# EAGLE schematic PDB_PCB_sch (EAGLE 9.6.2)
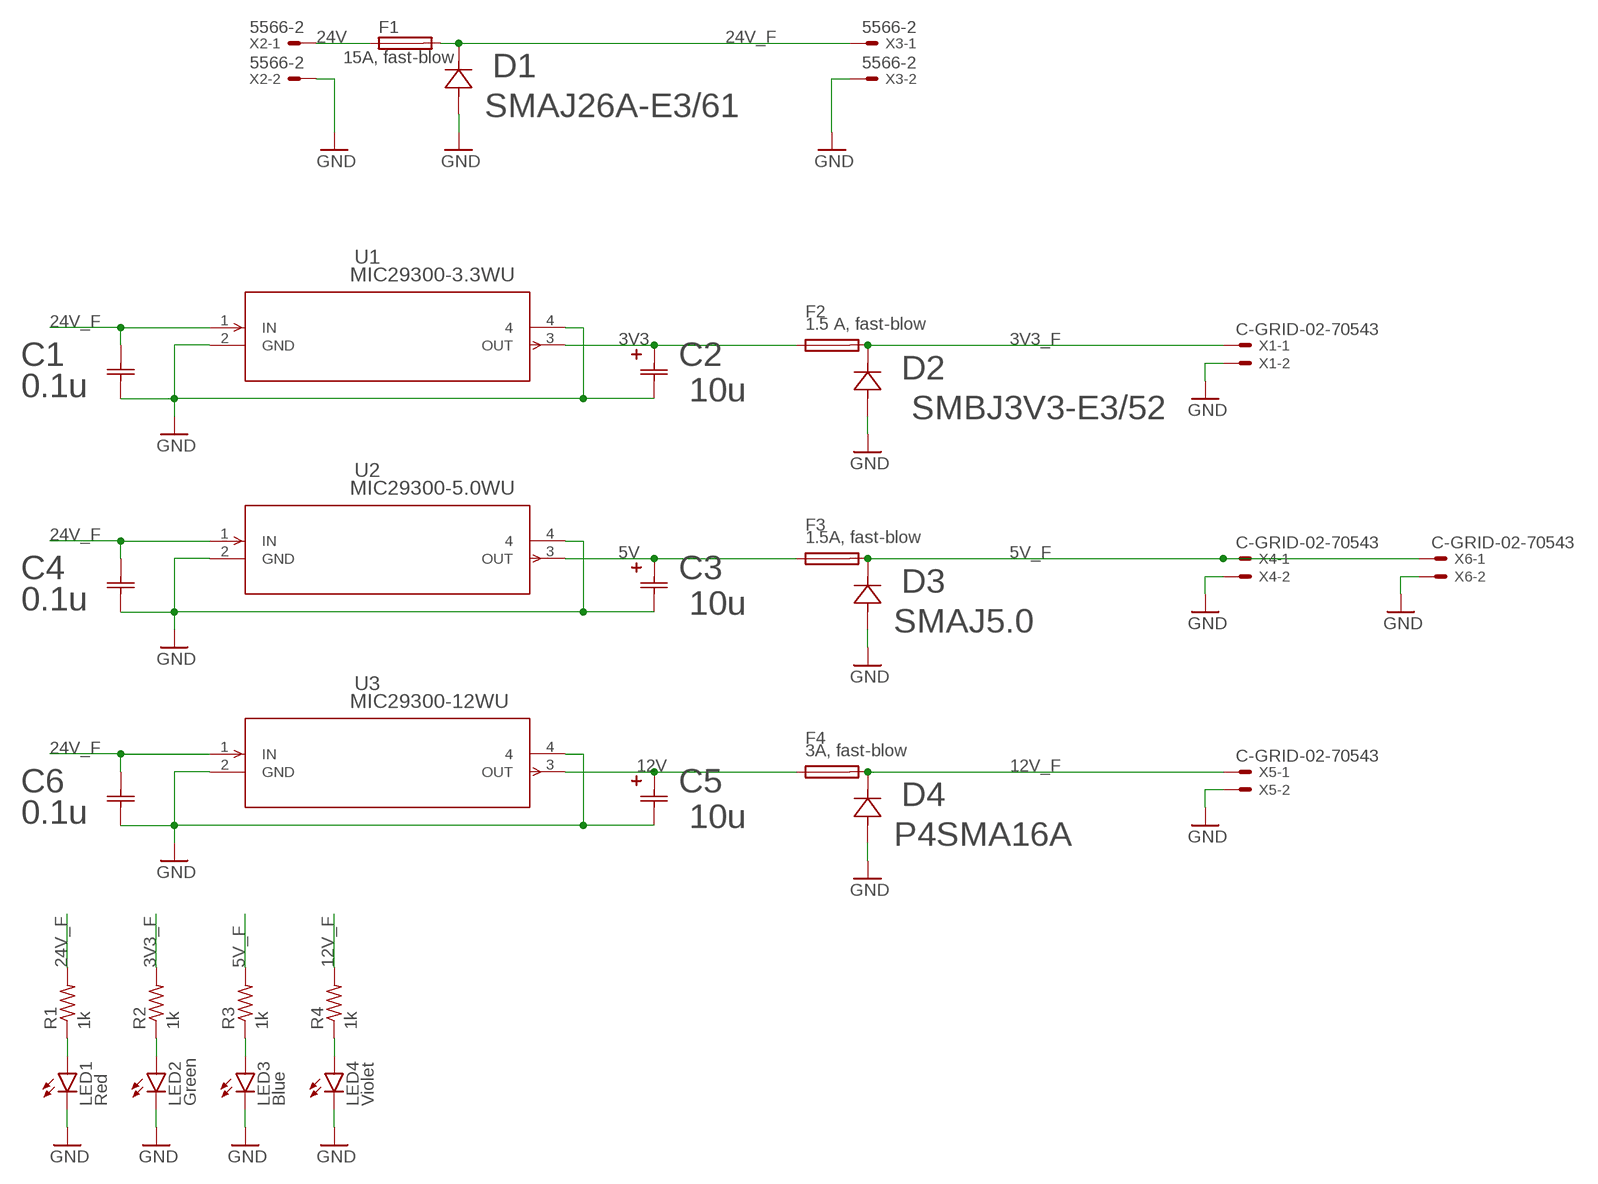
[diagram p0: schematic, sheet 1]

## Parts
C1  0.1u  0402B104M500CT  [CAP_0402_WAL]
C2  10u  TCSM1C106M8R  [CAP_TCS_M_ROM]
C3  10u  TCSM1C106M8R  [CAP_TCS_M_ROM]
C4  0.1u  0402B104M500CT  [CAP_0402_WAL]
C5  10u  TCSM1C106M8R  [CAP_TCS_M_ROM]
C6  0.1u  0402B104M500CT  [CAP_0402_WAL]
D1  SMAJ26A-E3/61  [DIODE_DO-214AC]
D2  SMBJ3V3-E3/52  [DO-214AC_VIS]
D3  SMAJ5.0  [SMASERIES_LTF]
D4  P4SMA16A  [P4SMASERIES_LTF]
F1  15A, fast-blow  TE5  [TE5]
F2  1.5 A, fast-blow  TE5  [TE5]
F3  1.5A, fast-blow  TE5  [TE5]
F4  3A, fast-blow  TE5  [TE5]
LED1  Red  LEDSMT1206  [1206]
LED2  Green  LEDSMT1206  [1206]
LED3  Blue  LEDSMT1206  [1206]
LED4  Violet  LEDSMT1206  [1206]
R1  1k  R-US_R0402  [R0402]
R2  1k  R-US_R0402  [R0402]
R3  1k  R-US_R0402  [R0402]
R4  1k  R-US_R0402  [R0402]
U1  MIC29300-3.3WU  [TO-263-3_MCL]
U2  MIC29300-5.0WU  [TO-263-3_MCL]
U3  MIC29300-12WU  [TO-263-3_MCL]
X1  C-GRID-02-70543  [70543-02]
X2  5566-2  [5566-2]
X3  5566-2  [5566-2]
X4  C-GRID-02-70543  [70543-02]
X5  C-GRID-02-70543  [70543-02]
X6  C-GRID-02-70543  [70543-02]

## Nets
3V3: C2.2 F2.1 U1.3(OUT)
3V3_F: D2.11 F2.2 R2.2 X1.1
5V: C3.2 F3.1 U2.3(OUT)
5V_F: D3.1 F3.2 R3.2 X4.1 X6.1
12V: C5.2 F4.1 U3.3(OUT)
12V_F: D4.1 F4.2 R4.2 X5.1
24V: F1.1 X2.1
24V_F: C1.1 C4.1 C6.1 R1.2 U1.1(IN) U2.1(IN) U3.1(IN)
GND: C1.2 C2.1 C3.1 C4.2 C5.1 C6.2 D1.2 D2.12 D3.2 D4.2 LED1.C LED2.C LED3.C LED4.C U1.2(GND) U1.4 U2.2(GND) U2.4 U3.2(GND) U3.4 X1.2 X2.2 X3.2 X4.2 X5.2 X6.2
N$1: LED1.A R1.1
N$3: LED2.A R2.1
N$5: LED3.A R3.1
N$6: D1.1 F1.2 X3.1
N$8: LED4.A R4.1

## Library data of the parts
C1 C4 C6 = PDB_PCB_lbr:0402B104M500CT; COPYRIGHT: Copyright (C) 2022 Ultra Librarian. All rights reserved.; DIGI-KEY_PART_NUMBER_1: 1292-1179-2-ND; DIGI-KEY_PART_NUMBER_2: 1292-1179-1-ND; DIGI-KEY_PART_NUMBER_3: 1292-1179-6-ND; MANUFACTURER_PART_NUMBER: 0402B104M500CT; MFR_NAME: Walsin
C2 C3 C5 = PDB_PCB_lbr:TCSM1C106M8R; COPYRIGHT: Copyright (C) 2022 Ultra Librarian. All rights reserved.; DIGI-KEY_PART_NUMBER_1: 511-TCSM1C106M8RTR-ND; DIGI-KEY_PART_NUMBER_2: 511-TCSM1C106M8RCT-ND; DIGI-KEY_PART_NUMBER_3: 511-TCSM1C106M8RDKR-ND; MANUFACTURER_PART_NUMBER: TCSM1C106M8R; MFR_NAME: ROHM Semiconductor
D1 = PDB_PCB_lbr:SMAJ26A-E3/61; COPYRIGHT: Copyright (C) 2022 Ultra Librarian. All rights reserved.; DIGI-KEY_PART_NUMBER_1: SMAJ26A-E3/61GICT-ND; DIGI-KEY_PART_NUMBER_2: SMAJ26A-E3/61GIDKR-ND; DIGI-KEY_PART_NUMBER_3: SMAJ26A-E3/61GITR-ND; MANUFACTURER_PART_NUMBER: SMAJ26A-E3/61; MFR_NAME: Vishay
D2 = PDB_PCB_lbr:SMBJ3V3-E3/52; COPYRIGHT: Copyright (C) 2022 Ultra Librarian. All rights reserved.; MANUFACTURER_PART_NUMBER: SMBJ3V3-E3/52; MFR_NAME: Vishay
D3 = PDB_PCB_lbr:SMAJ5.0; COPYRIGHT: Copyright (C) 2022 Ultra Librarian. All rights reserved.; DIGI-KEY_PART_NUMBER_1: F5678CT-ND; DIGI-KEY_PART_NUMBER_2: F5678DKR-ND; DIGI-KEY_PART_NUMBER_3: F5678TR-ND; DIGI-KEY_PART_NUMBER_4: 2997-SMAJ5.0TR-ND; MANUFACTURER_PART_NUMBER: SMAJ5.0; MFR_NAME: Littelfuse Inc
D4 = PDB_PCB_lbr:P4SMA16A; COPYRIGHT: Copyright (C) 2022 Ultra Librarian. All rights reserved.; DIGI-KEY_PART_NUMBER_1: 283-P4SMA16ATR-ND; DIGI-KEY_PART_NUMBER_2: 2997-P4SMA16ATR-ND; DIGI-KEY_PART_NUMBER_3: P4SMA16ABBCT-ND; DIGI-KEY_PART_NUMBER_4: P4SMA16ABBDKR-ND; DIGI-KEY_PART_NUMBER_5: P4SMA16ABBTR-ND; DIGI-KEY_PART_NUMBER_6: P4SMA16ACT-ND; DIGI-KEY_PART_NUMBER_7: P4SMA16ADKR-ND; DIGI-KEY_PART_NUMBER_8: P4SMA16ATR-ND; MANUFACTURER_PART_NUMBER: P4SMA16A; MFR_NAME: Littelfuse Inc
F1-F4 = fuse:TE5: FUSE Wickmann; OC_FARNELL: unknown; OC_NEWARK: unknown
LED1-LED4 = led:LED: LED OSRAM: - CHIPLED LG R971, LG N971, LY N971, LG Q971, LY Q971, LO R971, LY R971 LH N974, LH R974 LS Q976, LO Q976, LY Q976 LO Q996 - Hyper CHIPLED LW Q18S LB Q993, LB Q99A, LB R99A - SideLED LS A670, LO A670, LY A670, LG A670, LP A670 LB A673, LV A673, LT A673, LW A673 LH A674 LY A675 LS A676, LA A676, LO A676, LY A676, LW A676 LS A679, LY A679, LG A679 - Hyper Micro SIDELED® LS Y876, LA Y876, LO Y876, LY Y876 LT Y87S - SmartLED LW L88C, LW L88S LB L89C, LB L89S, LG L890 LS L89K, LO L89K, LY L89K LS L896, LA L896, LO L896, LY L896 - TOPLED LS T670, LO T670, LY T670, LG T670, LP T670 LSG T670, LSP T670, LSY T670, LOP T670, LYG T670 LG T671, LOG T671, LSG T671 LB T673, LV T673, LT T673, LW T673 LH T674 LS T676, LA T676, LO T676, LY T676, LB T676, LH T676, LSB T676, LW T676 LB T67C, LV T67C, LT T67C, LS T67K, LO T67K, LY T67K, LW E67C LS E67B, LA E67B, LO E67B, LY E67B, LB E67C, LV E67C, LT E67C LW T67C LS T679, LY T679, LG T679 LS T770, LO T770, LY T770, LG T770, LP T770 LB T773, LV T773, LT T773, LW T773 LH T774 LS E675, LA E675, LY E675, LS T675 LS T776, LA T776, LO T776, LY T776, LB T776 LHGB T686 LT T68C, LB T68C - Hyper Mini TOPLED® LB M676 - Mini TOPLED Santana® LG M470 LS M47K, LO M47K, LY M47K Source: http://www.osram.convergy.de LUXEON: - LUMILED® LXK2-PW12-R00, LXK2-PW12-S00, LXK2-PW14-U00, LXK2-PW14-V00 LXK2-PM12-R00, LXK2-PM12-S00, LXK2-PM14-U00 LXK2-PE12-Q00, LXK2-PE12-R00, LXK2-PE12-S00, LXK2-PE14-T00, LXK2-PE14-U00 LXK2-PB12-K00, LXK2-PB12-L00, LXK2-PB12-M00, LXK2-PB14-N00, LXK2-PB14-P00, LXK2-PB14-Q00 LXK2-PR12-L00, LXK2-PR12-M00, LXK2-PR14-Q00, LXK2-PR14-R00 LXK2-PD12-Q00, LXK2-PD12-R00, LXK2-PD12-S00 LXK2-PH12-R00, LXK2-PH12-S00 LXK2-PL12-P00, LXK2-PL12-Q00, LXK2-PL12-R00 Source: www.luxeon.com KINGBRIGHT: KA-3528ASYC Source: www.kingbright.com
R1-R4 = rcl:R-US_: RESISTOR, American symbol; SPICEPREFIX: R
U1 = PDB_PCB_lbr:MIC29300-3.3WU; COPYRIGHT: Copyright (C) 2022 Ultra Librarian. All rights reserved.; DIGI-KEY_PART_NUMBER_1: 576-1120-ND; MANUFACTURER_PART_NUMBER: MIC29300-3.3WU; MFR_NAME: Micrel
U2 = PDB_PCB_lbr:MIC29300-5.0WU; COPYRIGHT: Copyright (C) 2022 Ultra Librarian. All rights reserved.; DIGI-KEY_PART_NUMBER_1: 576-1122-ND; MANUFACTURER_PART_NUMBER: MIC29300-5.0WU; MFR_NAME: Micrel
U3 = PDB_PCB_lbr:MIC29300-12WU; COPYRIGHT: Copyright (C) 2022 Ultra Librarian. All rights reserved.; DIGI-KEY_PART_NUMBER_1: 576-2222-ND; DIGI-KEY_PART_NUMBER_2: MIC29300-12WU-CRL-ND; MANUFACTURER_PART_NUMBER: MIC29300-12WU; MFR_NAME: Micrel
X1 X4-X6 = con-molex:C-GRID-02: CONNECTOR wire to board 2.54 mm (0.100") pitch header; MF: MOLEX; OC_FARNELL: unknown; OC_NEWARK: unknown
X2 X3 = con-molex:5566-2: Mini FIT connector 2 pol Source: http://www.molex.com; MF: MOLEX; OC_FARNELL: 1822072; OC_NEWARK: unknown